# Altium project AEON.Feeder.BeamBreak.PrjPcb
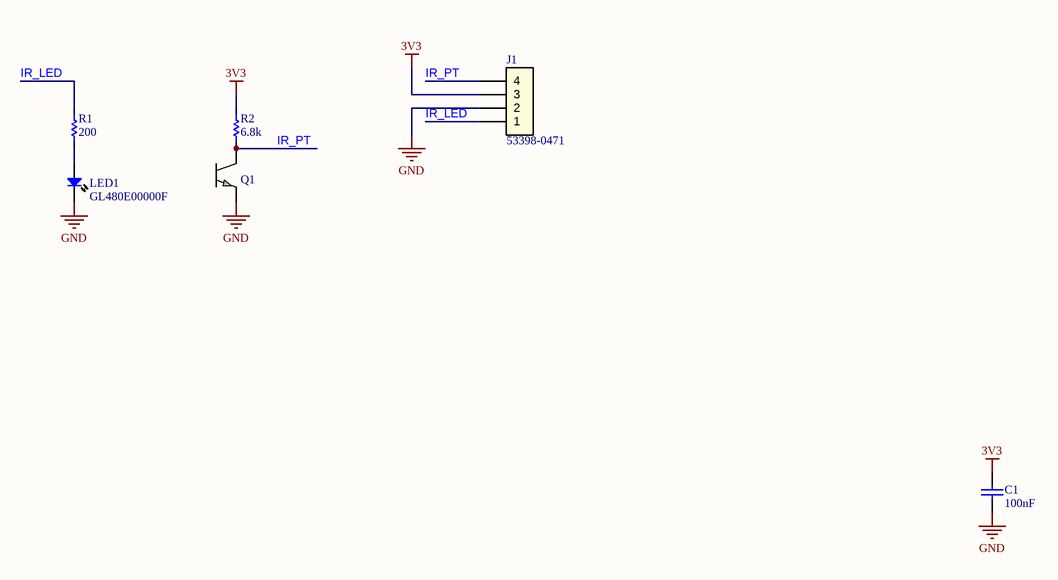
[diagram p0: AEON.Feeder.BeamBreak.SchDoc]
Project: AEON
1 sheet, 6 parts. Net scope: global (net labels, ports and power ports of the same name join across sheets).
Board file: AEON.Feeder.BeamBreak.PcbDoc

## Sheet AEON.Feeder.BeamBreak.SchDoc
size 297 x 209 mm; Revision: 1; SheetNumber: 1; SheetTotal: 1; swcgroup: FabLab; Org: Sainsbury Wellcome Centre; Add1: 25 Howland Street; Add2: London; Add3: W1T 4JG; WebAddress: www.sainsburywellcome.org; SheetSize: A4; SheetName: Feeder Beam Break

### Parts
C1  value 100nF  [FP-GRM188-0_1-e0_2_0_5-IPC_B]  (hidden comment: C0603-100nF-100V-10%-X7R)
J1  53398-0471  [FP-533980471-MFG]
LED1  GL480E00000F  [GL480_5.8mm]
Q1  PT480FE0000F  [PT480_5.8]  (value not drawn)
R1  value 200  [RES_ERA6A_0805_PAN]  (hidden comment: RES 0805 200R 0.1% 125mW)
R2  value 6.8k  [FP-CPF0603-IPC_B]  (hidden comment: R0603-6k8-1/16W-0.1%)

### Nets
3V3: C1.2 J1.3 R2.2
GND: C1.1 J1.2 LED1.1(C) Q1.1
IR_LED: J1.1 R1.2
IR_PT: J1.4 Q1.2 R2.1
NetLED1_2: LED1.2(A) R1.1

### Notes on the sheet
- VARIANT
- REVISION
- FILE
- APPR
- DATE
- SIZE
- SHEET
- /
- PROJECT

### Library data of the parts
C1 = CMP-611-0027-19: 0.1µF ±10% 100V Ceramic Capacitor X7R 0603 (1608 Metric); Pick&PlaceFootprint: 0603_CAP; Capacitor Type: Ceramic; Depth: 0.8mm; Tolerance: 10%; REACH SVHC: No SVHC; Package Quantity: 1; Size: 0.8mm; Case Code (Metric): 1608; RoHS Compliant: Yes; Radiation Hardening: No; Case/Package: 0603; Thickness: 0.035inch; Min Operating Temperature: -55°C; Construction: Flat; Lead Free: Lead Free; Material: Ceramic; Voltage: 100V; Mount: Surface Mount; Dielectric: X7R; Width: 0.8mm; Case Code (Imperial): 0603; Packaging: Tape and Reel; Termination: SMD/SMT; Weight: 0.000222oz; Capacitance: 100nF; Max Operating Temperature: 125°C; Length: 1.6mm; Voltage Rating: 100V; Voltage Rating (DC): 100V; Series: GRM; RoHS: Yes; Height: 0.8mm
J1 = CMP-370-0030-2: Board Connector, 4 Contact(s), 1 Row(s), Male, Straight, 0.049 inch Pitch, Surface Mount Terminal, Locking, Natural Insulator, Receptacle; Contact Resistance: 20mR; IEC Conformance: No; Polarization Key: POLARIZED HOUSING; Dielectric Withstanding Voltage (AC): 250V; Contact Pattern: RECTANGULAR; Number Of Connectors: 1; Board Mounting Option: FITTING NAIL; Reference Standard: UL; Option: General Purpose; Body Length: 0.383inch; Contact Style: Blade Pin; Number of Contacts: 4; Rated Current (Signal): 1A; Mating Information: MULTIPLE MATING PARTS AVAILABLE; Durability: 30Cycles; Body Depth: 0.185inch; Insulation Resistance: 100MR; Plating Thickness: 39uin; Body Breadth: 0.146inch; Reliability: COMMERCIAL; Flammability Rating: UL94 V-0; REACH SVHC: Yes; Body/Shell Style: RECEPTACLE; JESD-609 Code: e3; Contact Material: Bronze; Contact Finish - Mating: MATTE TIN (39) OVER NICKEL; Termination: SMD/SMT; Mount: Board; PartNumber: 53398-0471; Mixed Contacts: No; Terminal Pitch: 1.25mm; Insulation Color: Natural; Mating Contact Pitch: 0.049inch; Connector Type: BOARD CONNECTOR; PCB Contact Pattern: RECTANGULAR; RoHS Compliant: Yes; MIL Conformance: No; Contact Gender: Male; Number Of PCB Rows: 1; Number of Rows Loaded: 1; Min Operating Temperature: -40°C; Mounting Option 1: LOCKING; Insulation Material: Polyamide; Filter Feature: No; DIN Conformance: No; Contact Finish - Termination: Matte Tin (Sn) - with Nickel (Ni) barrier; Max Operating Temperature: 85°C; Mounting Style: STRAIGHT
LED1 = CMP-520-0009-6: EMITTER IR 950NM 50MA RADIAL; PartNumber: GL480E00000F; Mount: Through Hole
Q1 = CMP-500-0000-5: SHARP PT480FE0000F PHOTOTRANSISTOR; PartNumber: PT480FE0000F; Mount: Through Hole
R1 = CMP-633-0043-2: RES 0805 200 Ohm 0.1% 1/8W ±10ppm/°C Thin Film; Voltage Rating: 100V; Pick&PlaceFootprint: R0805; Resistance: 200; RoHS: Yes; Mount: Surface Mount; Tolerance: 0.1%; Case/Package: R0805; PartNumber: RES 0805 200R 0.1% 125mW; Power Rating: 125mW
R2 = CMP-633-0025-15: Surface Mount Resistor 6.8k Ohm 1/16 W 0.1% 0603 (1608 Metric); Temperature Coefficient: 25ppm/°C; Voltage Rating: 50V; Max Power Dissipation: 62.5 mW; Number of Resistors: 1; Pick&PlaceFootprint: R0603; Power Rating: 62.5mW; Series: CPF; Termination: Solder; Weight: 7.1E-05oz; Max Operating Temperature: 155°C; Number of Pins: 2; ELV: Compliant; Width: 0.8mm; Size Code: 0603; Tolerance: 0.1%; RoHS: Yes; Technology: Thin Film; Packaging: Tape and Reel; Resistance Tolerance: 0.1%; Composition: Thin Film; Resistance: 6.8k; RoHS Compliant: Yes; Case/Package: 0603; Min Operating Temperature: -55°C; Case Code (Imperial): 0603; Resistor Type: Thin Film; Case Code (Metric): 1608; Voltage Rating (DC): 50V; Number of Terminations: 2; Mount: Surface Mount; REACH SVHC: No SVHC; Length: 1.6mm; Height: 0.45mm